# EAGLE design OneButton (EAGLE 8.4.2)
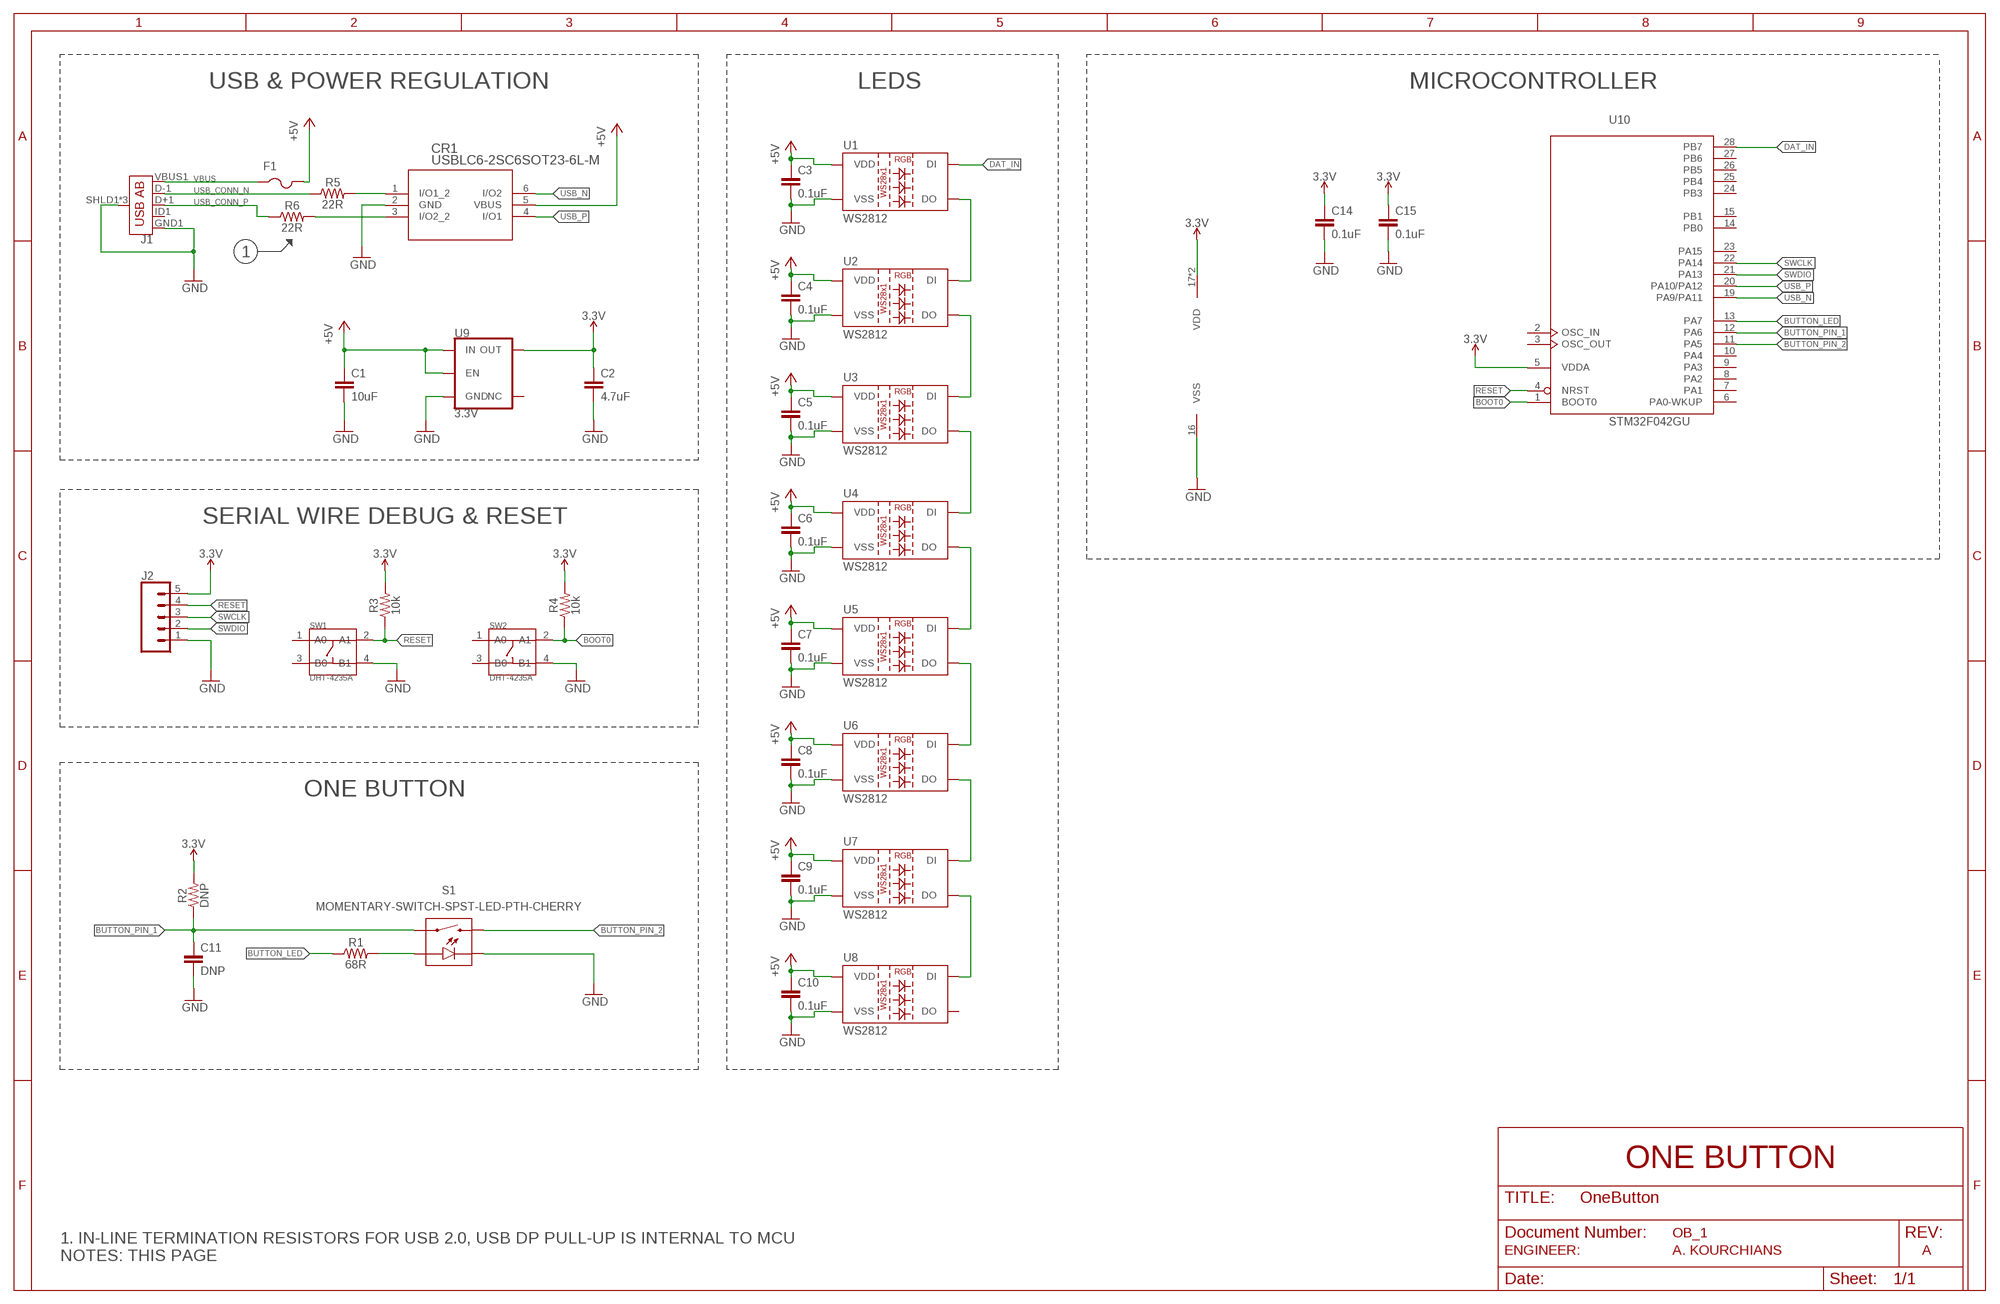
[diagram p0: schematic, sheet 1]

## Parts
C1  10uF  10UFCAP-1206  [CAP-1206]
C2  4.7uF  4.7UFCAP-1206  [CAP-1206]
C3  0.1uF  0.1UFCAP-0603  [CAP-0603]
C4  0.1uF  0.1UFCAP-0603  [CAP-0603]
C5  0.1uF  0.1UFCAP-0603  [CAP-0603]
C6  0.1uF  0.1UFCAP-0603  [CAP-0603]
C7  0.1uF  0.1UFCAP-0603  [CAP-0603]
C8  0.1uF  0.1UFCAP-0603  [CAP-0603]
C9  0.1uF  0.1UFCAP-0603  [CAP-0603]
C10  0.1uF  0.1UFCAP-0603  [CAP-0603]
C11  DNP  CAPACITORCAP-0603  [CAP-0603]
C14  0.1uF  0.1UFCAP-0603  [CAP-0603]
C15  0.1uF  0.1UFCAP-0603  [CAP-0603]
CR1  USBLC6-2SC6SOT23-6L-M  [SOT23-6L-M]
F1  PTCFUSE-1206  [R1206]
J1  USB_AB_SMT  [USB-AB-MICRO-SMD]
J2  CONN_05  [1X05]
R1  68R  RESISTORRES-0603  [RESC0603_N]
R2  DNP  RESISTORRES-0603  [RESC0603_N]
R3  10k  RESISTORRES-0603  [RESC0603_N]
R4  10k  RESISTORRES-0603  [RESC0603_N]
R5  22R  RESISTORRES-0603  [RESC0603_N]
R6  22R  RESISTORRES-0603  [RESC0603_N]
S1  MOMENTARY-SWITCH-SPST-LED-PTH-CHERRY  [CHERRY-MX-LED]
SW1  DHT-4235A  SMD-BUTTON-TOP-DHT-4235A(4P-4.2X3.2MM)  [SW4-SMD-4.2X3.2X2.5MM]
SW2  DHT-4235A  SMD-BUTTON-TOP-DHT-4235A(4P-4.2X3.2MM)  [SW4-SMD-4.2X3.2X2.5MM]
U1  WS2812  WS2812"  [LED-TRICOLOR-5050-IC]
U2  WS2812  WS2812"  [LED-TRICOLOR-5050-IC]
U3  WS2812  WS2812"  [LED-TRICOLOR-5050-IC]
U4  WS2812  WS2812"  [LED-TRICOLOR-5050-IC]
U5  WS2812  WS2812"  [LED-TRICOLOR-5050-IC]
U6  WS2812  WS2812"  [LED-TRICOLOR-5050-IC]
U7  WS2812  WS2812"  [LED-TRICOLOR-5050-IC]
U8  WS2812  WS2812"  [LED-TRICOLOR-5050-IC]
U9  3.3V  V_REG_AP2112K-3.3V  [SOT23-5]
U10  STM32F042GU  [UFQFPN28]

## Nets
5V: C2.1 C14.1 C15.1 J2.5 R2.2 R3.2 R4.2 U9.5(OUT) U10.5(VDDA) U10.17(VDD) U10.18(VDD) ; supply symbol labelled 3.3V
+5V: C1.1 C3.1 C4.1 C5.1 C6.1 C7.1 C8.1 C9.1 C10.1 CR1.5(VBUS) F1.2 U1.3(VDD) U1.5(VDD) U2.3(VDD) U2.5(VDD) U3.3(VDD) U3.5(VDD) U4.3(VDD) U4.5(VDD) U5.3(VDD) U5.5(VDD) U6.3(VDD) U6.5(VDD) U7.3(VDD) U7.5(VDD) U8.3(VDD) U8.5(VDD) U9.1(IN) U9.3(EN)
BOOT0: R4.1 SW2.2(A1) U10.1(BOOT0)
BUTTON_LED: R1.1 U10.13(PA7)
BUTTON_PIN_1: C11.1 R2.1 S1.S1 U10.12(PA6)
BUTTON_PIN_2: S1.S2 U10.11(PA5)
DAT_IN: U1.2(DI) U10.28(PB7)
GND: C1.2 C2.2 C3.2 C4.2 C5.2 C6.2 C7.2 C8.2 C9.2 C10.2 C11.2 C14.2 C15.2 CR1.2(GND) J1.GND1(GND) J1.SHLD1(SHIELD) J1.SHLD2(SHIELD) J1.SHLD3(SHIELD) J2.1 S1.K1(C) S1.K(C) SW1.4(B1) SW2.4(B1) U1.6(VSS) U2.6(VSS) U3.6(VSS) U4.6(VSS) U5.6(VSS) U6.6(VSS) U7.6(VSS) U8.6(VSS) U9.2(GND) U10.16(VSS)
N$6: R1.2 S1.A S1.A1(A)
N$9: U1.1(DO) U2.2(DI)
N$10: U2.1(DO) U3.2(DI)
N$11: U3.1(DO) U4.2(DI)
N$12: U4.1(DO) U5.2(DI)
N$13: U5.1(DO) U6.2(DI)
N$14: U6.1(DO) U7.2(DI)
N$15: U7.1(DO) U8.2(DI)
RESET: J2.4 R3.1 SW1.2(A1) U10.4(NRST)
SWCLK: J2.3 U10.22(PA14)
SWDIO: J2.2 U10.21(PA13)
USB_CONN_N: J1.D-1(D-) R5.1
USB_CONN_P: J1.D+1(D+) R6.1
USB_N: CR1.6(I/O2) U10.19(PA9/PA11)
USB_P: CR1.4(I/O1) U10.20(PA10/PA12)
USB_R_N: CR1.1(I/O1_2) R5.2
USB_R_P: CR1.3(I/O2_2) R6.2
VBUS: F1.1 J1.VBUS1(VBUS)
Unconnected: J1.ID1(USBID) SW1.1(A0) SW1.3(B0) SW2.1(A0) SW2.3(B0) U8.1(DO) U9.4(NC) U10.2(OSC_IN) U10.3(OSC_OUT) U10.6(PA0-WKUP) U10.7(PA1) U10.8(PA2) U10.9(PA3) U10.10(PA4) U10.14(PB0) U10.15(PB1) U10.23(PA15) U10.24(PB3) U10.25(PB4) U10.26(PB5) U10.27(PB6)

## Notes on the sheet
- USB & POWER REGULATION | LEDS | MICROCONTROLLER
- 1
- SERIAL WIRE DEBUG & RESET
- ONE BUTTON
- ONE BUTTON
- OB_1
- ENGINEER:                       A. KOURCHIANS | A
- 1. IN-LINE TERMINATION RESISTORS FOR USB 2.0, USB DP PULL-UP IS INTERNAL TO MCU
  NOTES: THIS PAGE

## Library data of the parts
C1 = OneButton:10UF: 10.0µF ceramic capacitors A capacitor is a passive two-terminal electrical component used to store electrical energy temporarily in an electric field.
C2 = OneButton:4.7UF: 4.7µF ceramic capacitors A capacitor is a passive two-terminal electrical component used to store electrical energy temporarily in an electric field.
C3-C10 C14 C15 = OneButton:0.1UF: 0.1µF ceramic capacitors A capacitor is a passive two-terminal electrical component used to store electrical energy temporarily in an electric field.
C11 = OneButton:CAPACITOR: Generic chip capacitor
CR1 = OneButton:USBLC6-2SC6; MANUFACTURER_PART_NUMBER: USBLC62SC6; VENDOR: ST Microelectronics
F1 = OneButton:PTCFUSE: PTC fuses, resettable thermistors
J1 = OneButton:USB_AB: USB Type AB Micro Connector OTG-compatible. 5 pins, 3 shield pins SparkFun Products: IOIO-OTG <https://www.sparkfun.com/products/13613> SparkFun SAMD21 Mini Breakout <https://www.sparkfun.com/products/13664>; MFG_NO: 10118192-0001LF; PROD_ID: CONN-11794
J2 = OneButton:CONN_05: Multi connection point. Often used as Generic Header-pin footprint for 0.1 inch spaced/style header connections On any of the 0.1 inch spaced packages, you can populate with these: Break Away Headers - Straight <https://www.sparkfun.com/products/116> (PRT-00116) Break Away Male Headers - Right Angle <https://www.sparkfun.com/products/553> (PRT-00553) Female Headers <https://www.sparkfun.com/products/115> (PRT-00115) Break Away Headers - Machine Pin <https://www.sparkfun.com/products/117> (PRT-00117) Break Away Female Headers - Swiss Machine Pin <https://www.sparkfun.com/products/743> (PRT-00743) For SCREWTERMINALS and SPRING TERMINALS visit here: Screw Terimnals on SparkFun.com <https://www.sparkfun.com/search/results?term=Screw+Terminals> (5mm/3.5mm/2.54mm spacing) This device is also useful as a general connection point to wire up your design to another part of your project. Our various solder wires solder well into these plated through hole pads. Hook-Up Wire - Assortment (Stranded, 22 AWG) <https://www.sparkfun.com/products/11375> (PRT-11375) Hook-Up Wire - Assortment (Solid Core, 22 AWG) <https://www.sparkfun.com/products/11367> (PRT-11367) View the entire wire category on our website here <https://www.sparkfun.com/categories/141> Special notes: Molex polarized connector foot print use with SKU : PRT-08231 with associated crimp pins and housings. 1MM SMD Version SKU: PRT-10208
R1-R6 = OneButton:RESISTOR: Generic Resistor Package
S1 = OneButton:MOMENTARY-SWITCH-SPST-LED: Momentary Switch (Pushbutton) - SPST - w/ LED Normally-open (NO) SPST momentary switches (buttons, pushbuttons), with a built-in LED. Variants PTH-CHERRY - Cherry MX Switch Cherry MX Keyswitches are top-of-the-line mechanical keyboard switches. They’re satisfyingly “clicky”, reliable up to tens-of-millions of key presses, and a standard in gaming and programming keyboards across the globe. This ‘blue’ version Cherry MX Switch is favored by most due to its secondary internal actuator making it less likely to “double-tap.” If you are looking for a noticeably audible and high-quality key switch, this is the perfect option for you! Cherry MX Switch <https://www.sparkfun.com/products/13834> (COM-13834) Cherry MX Switch Breakout <https://www.sparkfun.com/products/13773> (BOB-13773) PTH-12MM and PTH-12MM-KIT - 12mm Illuminated LED KIT variant is for soldering kits. There is no tStop (covering up the top side of the pads with mask). This helps the beginner see which side they should be soldering too. LED Tactile Button Breakout <https://www.sparkfun.com/products/10467> (BOB-10467) LED Tactile Button - Red <https://www.sparkfun.com/products/10442> (COM-10442) LED Tactile Button - Blue <https://www.sparkfun.com/products/10443> (COM-10443) LED Tactile Button - Green <https://www.sparkfun.com/products/10440> (COM-10440) LED Tactile Button - Orange <https://www.sparkfun.com/products/10441> (COM-10441) LED Tactile Button - White <https://www.sparkfun.com/products/10439> (COM-10439); SF_ID: COM-13834; SPICEPREFIX: S
SW1 SW2 = OneButton:SMD-BUTTON-TOP-DHT-4235A(4P-4.2X3.2MM): 311020045; MFG_NO: PTS810 SJK 250 SMTR LFS; MPN: DHT-4235A
U1-U8 = OneButton:WS2812: WS2812 RGB LED w/ WS2811 driver 5x5mm SMD LED with built-in controller IC. Color: Red/Green/Blue mC Rating: RGB: 550, 1100, 200 mcd Current:RGB: 20, 20, 20 mA Forward Voltage: RGB: 1.8, 3.0, 3.2 V Packages:LED-TRICOLOR-5050-IC SparkFun Products: LED-SMD RGB (WS2812) <https://www.sparkfun.com/products/11821>; MFG_NO: 1655; PROD_ID: DIO-11598
U9 = OneButton:V_REG_AP2112: AP2112 - 600mA CMOS LDO Regulator w/ Enable The AP2112 is CMOS process low dropout linear regulator with enable function, the regulator delivers a guaranteed 600mA (min.) continuous load current. Features Output Voltage Accuracy: ±1.5% Output Current: 600mA (Min.) Foldback Short Current Protection: 50mA Enable Function to Turn ON/OFF VOUT Low Dropout Voltage (3.3V): 250mV (Typ.) @IOUT=600mA Excellent Load Regulation: 0.2%/A (Typ.) Excellent Line Regulation: 0.02%/V (Typ.) Low Quiescent Current: 55μA (Typ.) Low Standby Current: 0.01μA (Typ.) Low Output Noise: 50μVRMS PSRR: 100Hz -65dB, 1kHz -65dB OTSD Protection Stable with 1.0μF Flexible Cap: Ceramic, Tantalum and Aluminum Electrolytic Operation Temperature Range: -40°C to 85°C ESD: MM 400V, HBM 4000V; MFG_NO: AP2112K-3.3TRG1; PROD_ID: VREG-12457
U10 = OneButton:STM32F042G*U

## Board
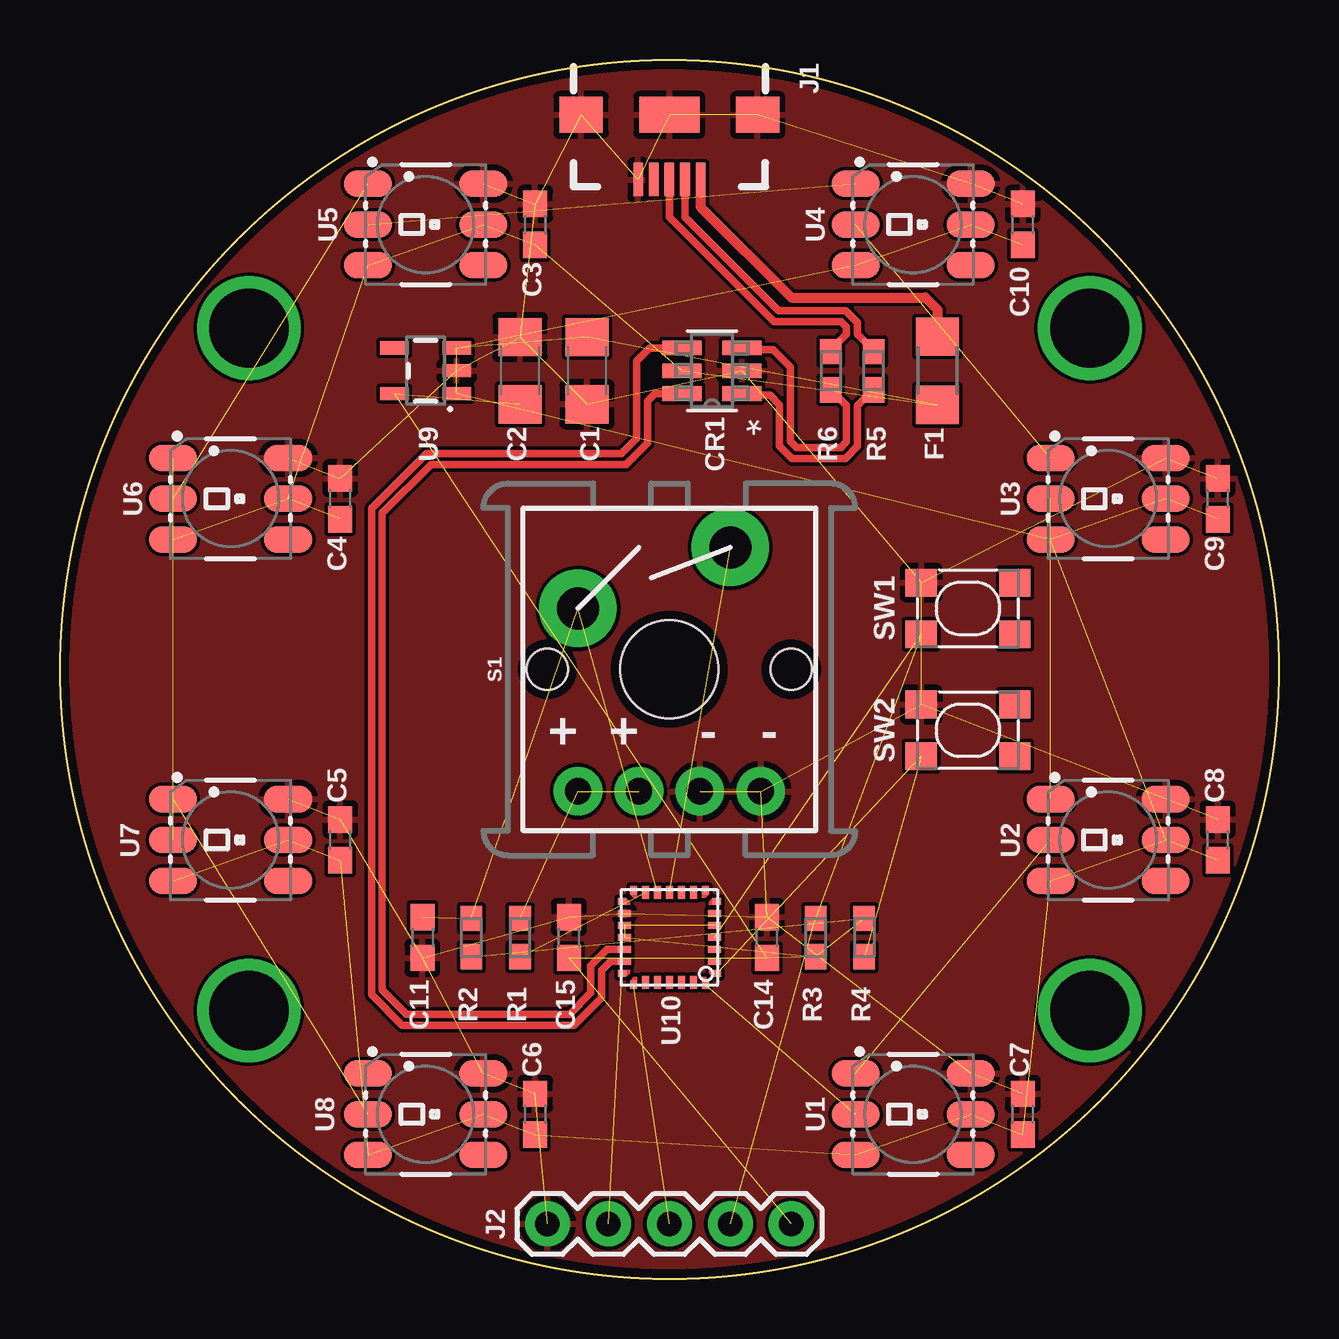
[diagram p1: board, top side]
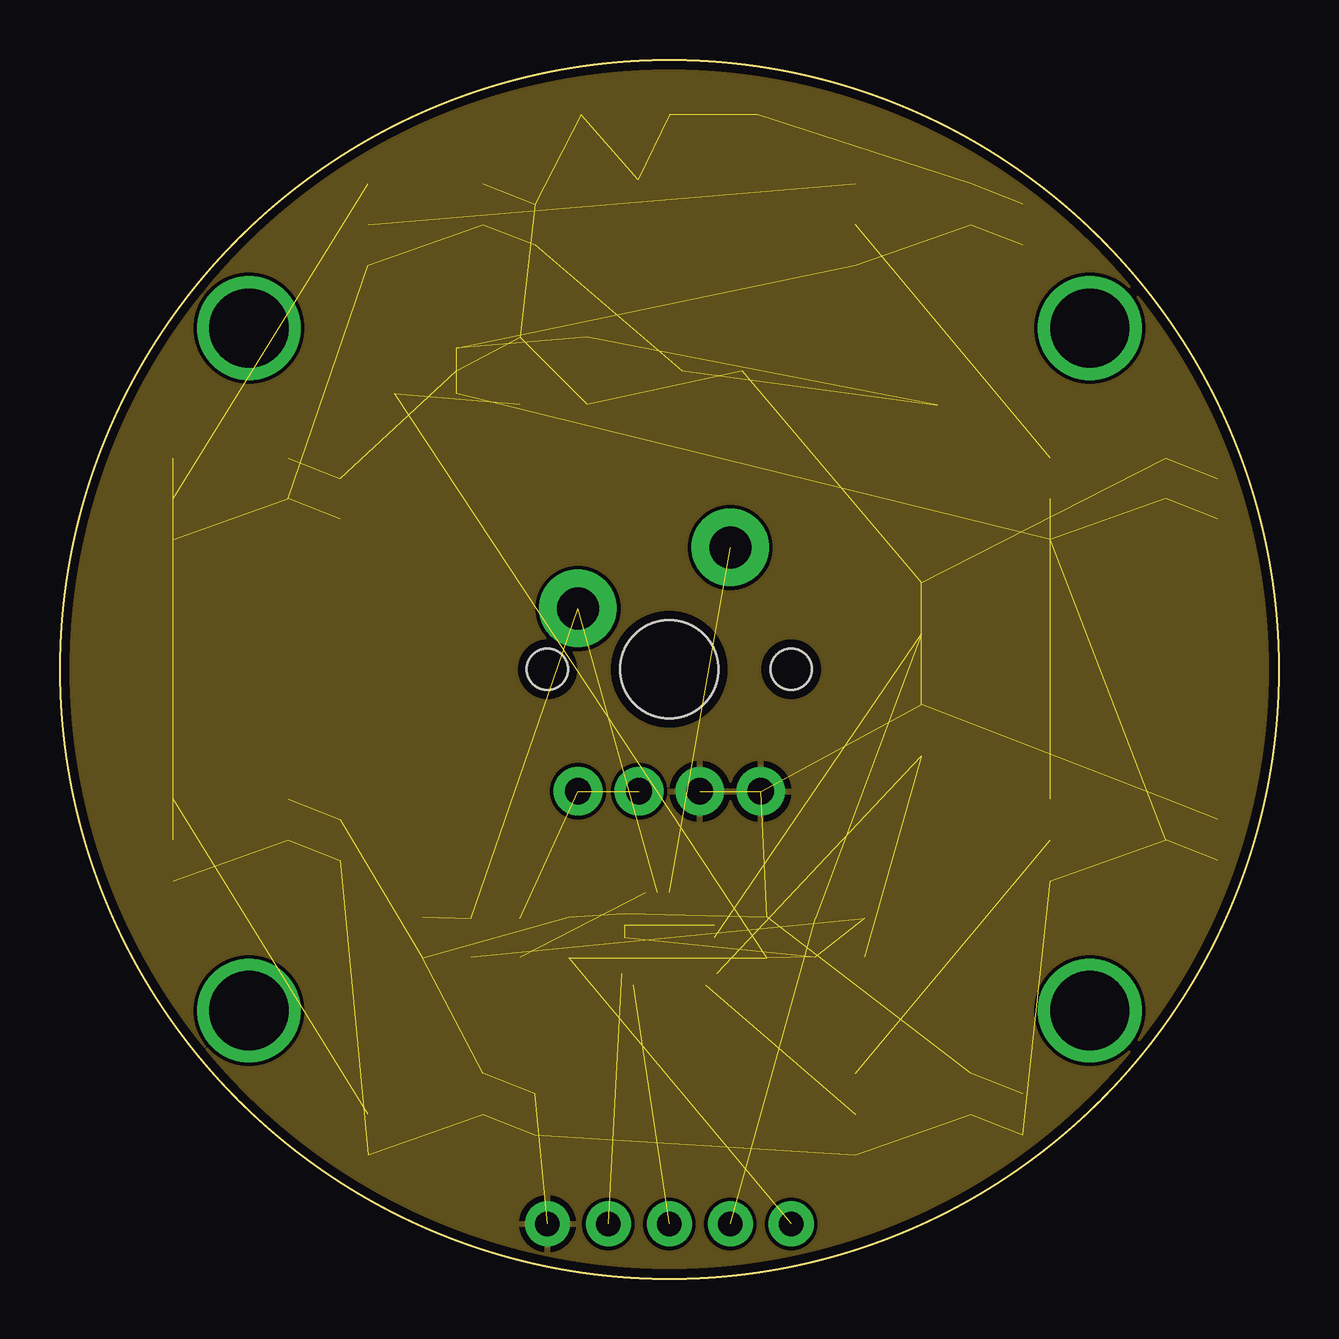
[diagram p2: board, inner layer Route2]
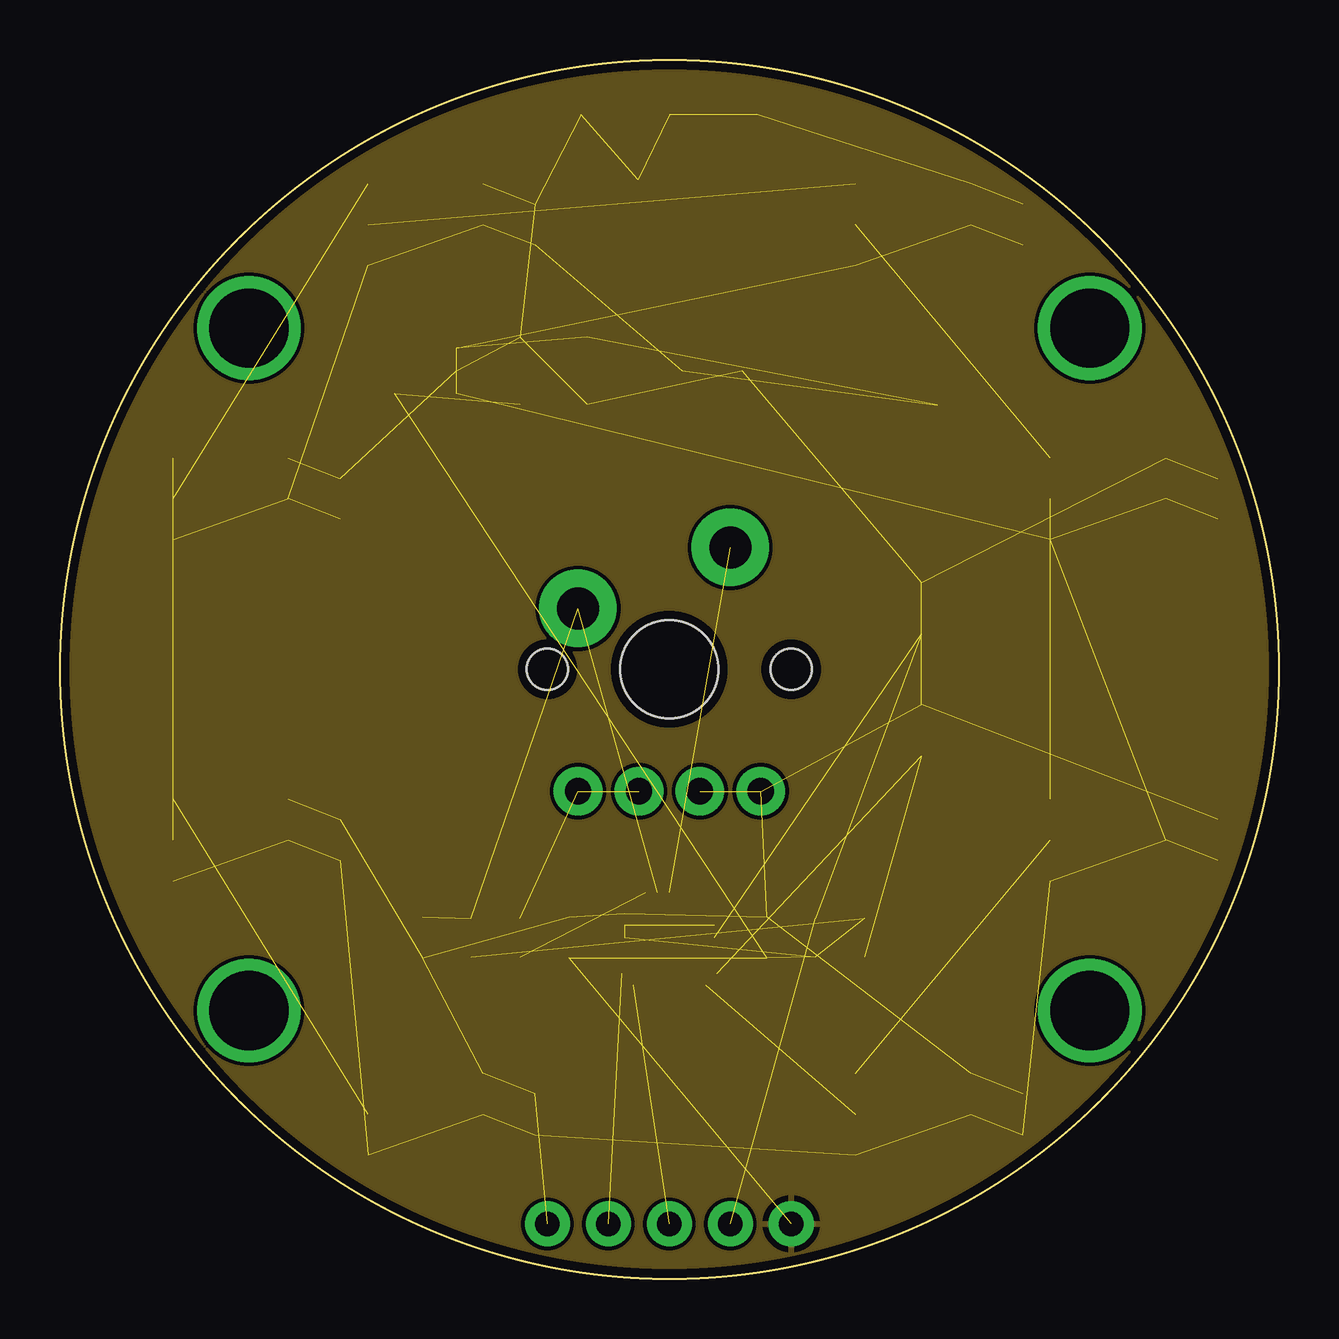
[diagram p3: board, inner layer Route15]

Size 50.8 x 50.8 mm. Coordinates in mm from the lower left corner, seen from the top.
Outline: circle at 25.4,25.4 radius 25.4
Copper layers (1*2*15*16): Top 0.035559375mm / dielectric 0.47751875mm / Route2 0.035559375mm / dielectric 0.47751875mm / Route15 0.035559375mm / dielectric 0.47751875mm / Bottom 0.035559375mm
Design rules "4-layer-FAB-LIMIT_6MIL": minimum track width 6mil, minimum drill 13mil, track to track 6mil, track to pad 6mil, pad to pad 6mil, via to via 6mil, smd to smd 6mil, copper to edge 15mil, drill to drill 6mil, minimum pad ring 7mil, minimum via ring 7mil, stop-mask expansion 3mil, vias tented up to drill 0mil, thermal gap 10mil

### Footprints (pad centres in the part's own frame; a part is rotated, then mirrored left to right if it is on the bottom)
CAP-1206 = smd 1.6 x 1.8: 1 -1.4,0; 2 1.4,0
CAP-0603 = smd 1.1 x 1: 1 -0.85,0; 2 0.85,0
SOT23-6L-M = smd 1.626 x 0.61: 1 -1.245,0.95; 2 -1.245,0; 3 -1.245,-0.95; 4 1.245,-0.95; 5 1.245,0; 6 1.245,0.95
R1206 = smd 1.6 x 1.803: 1 -1.422,0; 2 1.422,0
USB-AB-MICRO-SMD = smd 1.4 x 0.4: D+1 2.7,0; D-1 2.7,0.65; GND1 2.7,-1.3; ID1 2.7,-0.65; VBUS1 2.7,1.3 | smd 1.5 x 1.8: SHLD1 0,-3.68; SHLD2 0,3.68 | smd 1.5 x 2.5: SHLD3 0,0
1X05 = drill 1.016 pad 1.88: 1 0,0; 2 2.54,0; 3 5.08,0; 4 7.62,0; 5 10.16,0
RESC0603_N = smd 1.05 x 0.9: 1 -0.8,0; 2 0.8,0
CHERRY-MX-LED = drill 1.092 pad 2.032: A -1.27,-5.08; A1 -3.81,-5.08; K 1.27,-5.08; K1 3.81,-5.08 | drill 1.753 pad 3.226: S1 -3.81,2.54; S2 2.54,5.08 | hole 4.089: 0,0 | hole 1.707: -5.08,0; 5.08,0
SW4-SMD-4.2X3.2X2.5MM = smd 1.3 x 1.15: 1 -1.95,1.075; 2 1.95,1.075; 3 -1.95,-1.075; 4 1.95,-1.075
LED-TRICOLOR-5050-IC = smd 2 x 1.1: 1 -2.4,1.7; 2 -2.4,0; 3 -2.4,-1.7; 4 2.4,-1.7; 5 2.4,0; 6 2.4,1.7
SOT23-5 = smd 0.55 x 1.2: 1 -0.95,-1.3; 2 0,-1.3; 3 0.95,-1.3; 4 0.95,1.3; 5 -0.95,1.3
UFQFPN28 = smd 0.35 x 0.3: 1 -1.975,1.5; 7 -1.975,-1.5; 15 1.975,-1.5; 21 1.975,1.5 | smd 0.55 x 0.3: 2 -1.875,1; 3 -1.875,0.5; 4 -1.875,0; 5 -1.875,-0.5; 6 -1.875,-1; 16 1.875,-1; 17 1.875,-0.5; 18 1.875,0; 19 1.875,0.5; 20 1.875,1 | smd 0.3 x 0.35: 8 -1.5,-1.975; 14 1.5,-1.975; 22 1.5,1.975; 28 -1.5,1.975 | smd 0.3 x 0.55: 9 -1,-1.875; 10 -0.5,-1.875; 11 0,-1.875; 12 0.5,-1.875; 13 1,-1.875; 23 1,1.875; 24 0.5,1.875; 25 0,1.875; 26 -0.5,1.875; 27 -1,1.875

### Placement (x,y rotation side)
C1  21.97,37.85 270 top
C2  19.18,37.85 90 top
C3  19.81,43.94 90 top
C4  11.68,32.51 90 top
C5  11.68,18.29 90 top
C6  19.81,6.86 90 top
C7  40.13,6.86 90 top
C8  48.26,18.29 90 top
C9  48.26,32.51 90 top
C10  40.13,43.94 90 top
C11  15.11,14.22 270 top
C14  29.46,14.22 90 top
C15  21.21,14.22 90 top
CR1  27.18,37.85 180 top
F1  36.58,37.85 270 top
J1  25.4,48.51 270 top
J2  20.32,2.29 0 top
R1  19.18,14.22 90 top
R2  17.14,14.22 270 top
R3  31.5,14.22 270 top
R4  33.53,14.22 90 top
R5  33.91,37.85 270 top
R6  32.13,37.85 270 top
S1  25.4,25.4 0 top
SW1  37.85,27.94 180 top
SW2  37.85,22.86 180 top
U1  35.56,6.86 0 top
U2  43.69,18.29 0 top
U3  43.69,32.51 0 top
U4  35.56,43.94 0 top
U5  15.24,43.94 0 top
U6  7.11,32.51 0 top
U7  7.11,18.29 0 top
U8  15.24,6.86 0 top
U9  15.24,37.85 90 top
U10  25.4,14.22 180 top

### Tracks (layer width: path | path; a pad name or v marks a point on that pad's centre or on a via)
5V  (10 unrouted)
  pour Route15: -0.51,-0.51 -0.51,51.31 51.31,51.31 51.31,-0.51
+5V  (28 unrouted)
BOOT0  (2 unrouted)
BUTTON_LED  (1 unrouted)
BUTTON_PIN_1  (3 unrouted)
BUTTON_PIN_2  (1 unrouted)
DAT_IN  (1 unrouted)
GND  (32 unrouted)
  pour Route2: -0.51,-0.51 -0.51,51.31 51.31,51.31 51.31,-0.51
  pour Top: -0.51,-0.51 -0.51,51.31 51.31,51.31 51.31,-0.51
N$1  (via drill 3.3)
  other vias: 7.87,39.62 42.93,39.62 42.93,11.18 7.87,11.18
N$6  (2 unrouted)
N$9  (1 unrouted)
N$10  (1 unrouted)
N$11  (1 unrouted)
N$12  (1 unrouted)
N$13  (1 unrouted)
N$14  (1 unrouted)
N$15  (1 unrouted)
RESET  (3 unrouted)
SWCLK  (1 unrouted)
SWDIO  (1 unrouted)
USB_CONN_N
  Top 0.305: J1.D-1 26.05,44.25 29.94,40.36 32.73,40.36 33.25,39.85 33.25,39.37 33.91,38.71 R5.1
USB_CONN_P
  Top 0.305: J1.D+1 25.4,44.25 29.75,39.9 32.54,39.9 32.79,39.66 32.79,39.37 32.13,38.71 R6.1
USB_N
  Top 0.305: U10.19 22.8,13.72 22.12,13.05 22.12,11.91 21.24,11.02 14.45,11.02 13.44,12.03 13.44,31.91 15.46,33.93 23.59,33.93 24.49,34.83 24.49,36.58 24.81,36.9 CR1.6
USB_P
  Top 0.305: U10.20 22.95,13.22 22.58,12.86 22.58,11.72 21.43,10.57 14.26,10.57 12.98,11.84 12.98,32.1 15.27,34.39 23.4,34.39 24.03,35.02 24.03,38.25 24.57,38.8 CR1.4
USB_R_N
  Top 0.305: CR1.1 28.49,36.83 29.59,36.83 30,36.42 30,34.7 30.51,34.19 32.73,34.19 33.25,34.7 33.25,36.39 R5.2
USB_R_P
  Top 0.305: CR1.3 28.48,38.73 29.72,38.73 30.45,38 30.45,34.89 30.7,34.65 32.54,34.65 32.79,34.89 32.79,36.39 R6.2
VBUS
  Top 0.406: J1.VBUS1 26.7,44.67 30.48,40.89 36.07,40.89 36.58,40.39 F1.1